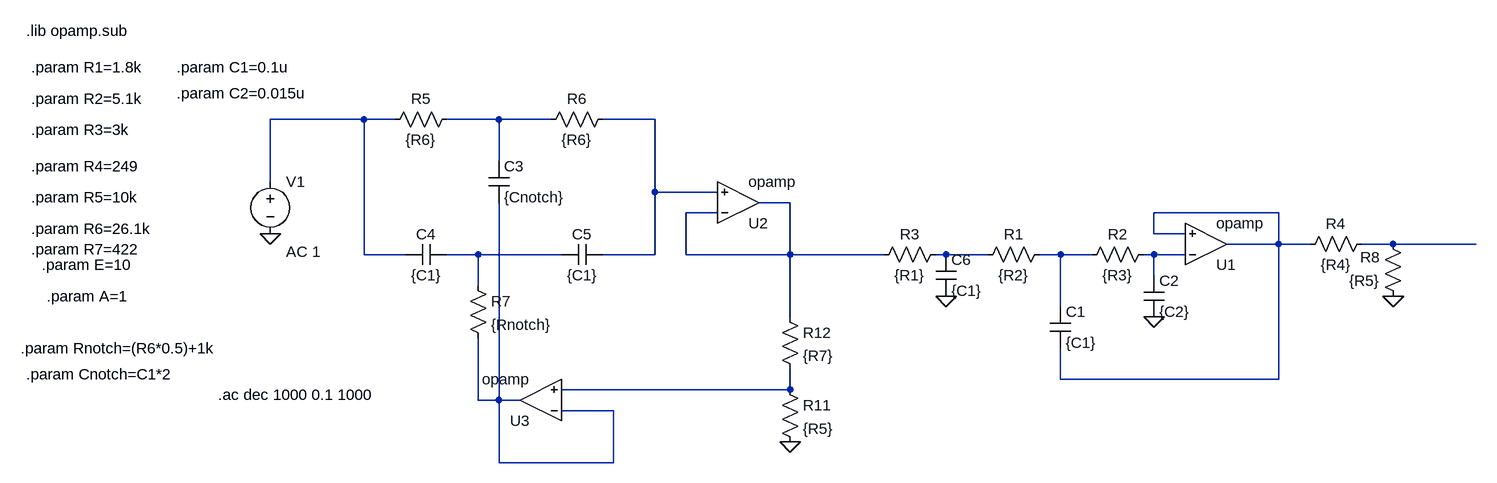
[diagram p0: schematic twint-lowpass-prototype.asc]
twint-lowpass-prototype.asc, the LTspice schematic file:
Version 4
SHEET 1 1764 1172
WIRE 48 -32 -96 -32
WIRE 96 -32 48 -32
WIRE 256 -32 176 -32
WIRE 336 -32 256 -32
WIRE 496 -32 416 -32
WIRE 256 32 256 -32
WIRE -96 64 -96 -32
WIRE 496 80 496 -32
WIRE 592 80 496 80
WIRE 704 96 656 96
WIRE 592 112 544 112
WIRE 1456 112 1264 112
WIRE 1264 144 1264 112
WIRE 1312 144 1264 144
WIRE 1456 160 1456 112
WIRE 1456 160 1376 160
WIRE 1504 160 1456 160
WIRE 1632 160 1584 160
WIRE 1760 160 1632 160
WIRE 48 176 48 -32
WIRE 112 176 48 176
WIRE 224 176 176 176
WIRE 352 176 224 176
WIRE 496 176 496 80
WIRE 496 176 416 176
WIRE 544 176 544 112
WIRE 704 176 704 96
WIRE 704 176 544 176
WIRE 848 176 704 176
WIRE 944 176 928 176
WIRE 1008 176 944 176
WIRE 1120 176 1088 176
WIRE 1168 176 1120 176
WIRE 1264 176 1248 176
WIRE 1312 176 1264 176
WIRE 1264 208 1264 176
WIRE 224 224 224 176
WIRE 1120 256 1120 176
WIRE 704 272 704 176
WIRE 1120 368 1120 320
WIRE 1456 368 1456 160
WIRE 1456 368 1120 368
WIRE 704 384 704 352
WIRE 704 384 352 384
WIRE 224 400 224 304
WIRE 256 400 256 96
WIRE 256 400 224 400
WIRE 288 400 256 400
WIRE 432 416 352 416
WIRE 256 496 256 400
WIRE 432 496 432 416
WIRE 432 496 256 496
FLAG 1264 272 0
FLAG -96 144 0
FLAG 704 464 0
FLAG 944 240 0
FLAG 1632 240 0
SYMBOL res 1104 160 R90
WINDOW 0 0 56 VBottom 2
WINDOW 3 32 56 VTop 2
SYMATTR InstName R1
SYMATTR Value {R2}
SYMATTR SpiceLine tol={E}
SYMBOL res 1264 160 R90
WINDOW 0 0 56 VBottom 2
WINDOW 3 32 56 VTop 2
SYMATTR InstName R2
SYMATTR Value {R3}
SYMATTR SpiceLine tol={E}
SYMBOL cap 1104 256 R0
SYMATTR InstName C1
SYMATTR Value {C1}
SYMBOL cap 1248 208 R0
SYMATTR InstName C2
SYMATTR Value {C2}
SYMBOL voltage -96 48 R0
WINDOW 123 24 124 Left 2
WINDOW 39 0 0 Left 0
SYMATTR Value2 AC 1
SYMATTR InstName V1
SYMATTR Value ""
SYMBOL res 192 -48 R90
WINDOW 0 0 56 VBottom 2
WINDOW 3 32 56 VTop 2
SYMATTR InstName R5
SYMATTR Value {R6}
SYMATTR SpiceLine tol={A}
SYMBOL res 432 -48 R90
WINDOW 0 0 56 VBottom 2
WINDOW 3 32 56 VTop 2
SYMATTR InstName R6
SYMATTR Value {R6}
SYMATTR SpiceLine tol={A}
SYMBOL cap 240 32 R0
SYMATTR InstName C3
SYMATTR Value {Cnotch}
SYMBOL cap 176 160 R90
WINDOW 0 0 32 VBottom 2
WINDOW 3 32 32 VTop 2
SYMATTR InstName C4
SYMATTR Value {C1}
SYMBOL cap 416 160 R90
WINDOW 0 0 32 VBottom 2
WINDOW 3 32 32 VTop 2
SYMATTR InstName C5
SYMATTR Value {C1}
SYMBOL res 208 208 R0
SYMATTR InstName R7
SYMATTR Value {Rnotch}
SYMATTR SpiceLine tol={A}
SYMBOL res 688 368 R0
SYMATTR InstName R11
SYMATTR Value {R5}
SYMATTR SpiceLine tol={E}
SYMBOL res 688 256 R0
SYMATTR InstName R12
SYMATTR Value {R7}
SYMATTR SpiceLine tol={E}
SYMBOL res 944 160 R90
WINDOW 0 0 56 VBottom 2
WINDOW 3 32 56 VTop 2
SYMATTR InstName R3
SYMATTR Value {R1}
SYMATTR SpiceLine tol={E}
SYMBOL cap 928 176 R0
SYMATTR InstName C6
SYMATTR Value {C1}
SYMBOL res 1600 144 R90
WINDOW 0 0 56 VBottom 2
WINDOW 3 32 56 VTop 2
SYMATTR InstName R4
SYMATTR Value {R4}
SYMATTR SpiceLine tol={E}
SYMBOL res 1648 256 R180
WINDOW 0 36 76 Left 2
WINDOW 3 36 40 Left 2
SYMATTR InstName R8
SYMATTR Value {R5}
SYMATTR SpiceLine tol={E}
SYMBOL Opamps\\opamp 1344 224 M180
SYMATTR InstName U1
SYMBOL Opamps\\opamp 624 160 M180
SYMATTR InstName U2
SYMBOL Opamps\\opamp 320 464 R180
SYMATTR InstName U3
TEXT -472 -168 Left 2 !.lib opamp.sub
TEXT -176 392 Left 2 !.ac dec 1000 0.1 1000
TEXT -464 -112 Left 2 !.param R1=1.8k
TEXT -240 -112 Left 2 !.param C1=0.1u
TEXT -240 -72 Left 2 !.param C2=0.015u
TEXT -464 -64 Left 2 !.param R2=5.1k
TEXT -464 -16 Left 2 !.param R3=3k
TEXT -464 40 Left 2 !.param R4=249
TEXT -464 88 Left 2 !.param R5=10k
TEXT -464 136 Left 2 !.param R6=26.1k
TEXT -448 192 Left 2 !.param E=10
TEXT -440 240 Left 2 !.param A=1
TEXT -464 168 Left 2 !.param R7=422
TEXT -480 320 Left 2 !.param Rnotch=(R6*0.5)+1k
TEXT -472 360 Left 2 !.param Cnotch=C1*2

The netlist it stands for:
* twint-lowpass-prototype.asc
R1 N009 N008 {R2} tol={E}
R2 N010 N009 {R3} tol={E}
C1 N009 N005 {C1}
C2 N010 0 {C2}
V1 N001 0 AC 1
R5 N002 N001 {R6} tol={A}
R6 N003 N002 {R6} tol={A}
C3 N002 N012 {Cnotch}
C4 N007 N001 {C1}
C5 N003 N007 {C1}
R7 N007 N012 {Rnotch} tol={A}
R11 N011 0 {R5} tol={E}
R12 N004 N011 {R7} tol={E}
R3 N008 N004 {R1} tol={E}
C6 N008 0 {C1}
R4 N006 N005 {R4} tol={E}
R8 0 N006 {R5} tol={E}
XU1 N010 N005 N005 opamp Aol=100K GBW=10Meg  ; pins invin noninvin out
XU2 N004 N003 N004 opamp Aol=100K GBW=10Meg  ; pins invin noninvin out
XU3 N012 N011 N012 opamp Aol=100K GBW=10Meg  ; pins invin noninvin out
.lib opamp.sub
.ac dec 1000 0.1 1000
.param R1=1.8k
.param C1=0.1u
.param C2=0.015u
.param R2=5.1k
.param R3=3k
.param R4=249
.param R5=10k
.param R6=26.1k
.param E=10
.param A=1
.param R7=422
.param Rnotch=(R6*0.5)+1k
.param Cnotch=C1*2
.backanno
.end